# Altium schematic sheet 4-PWR_MANAGE_3.SCHDOC
size A4
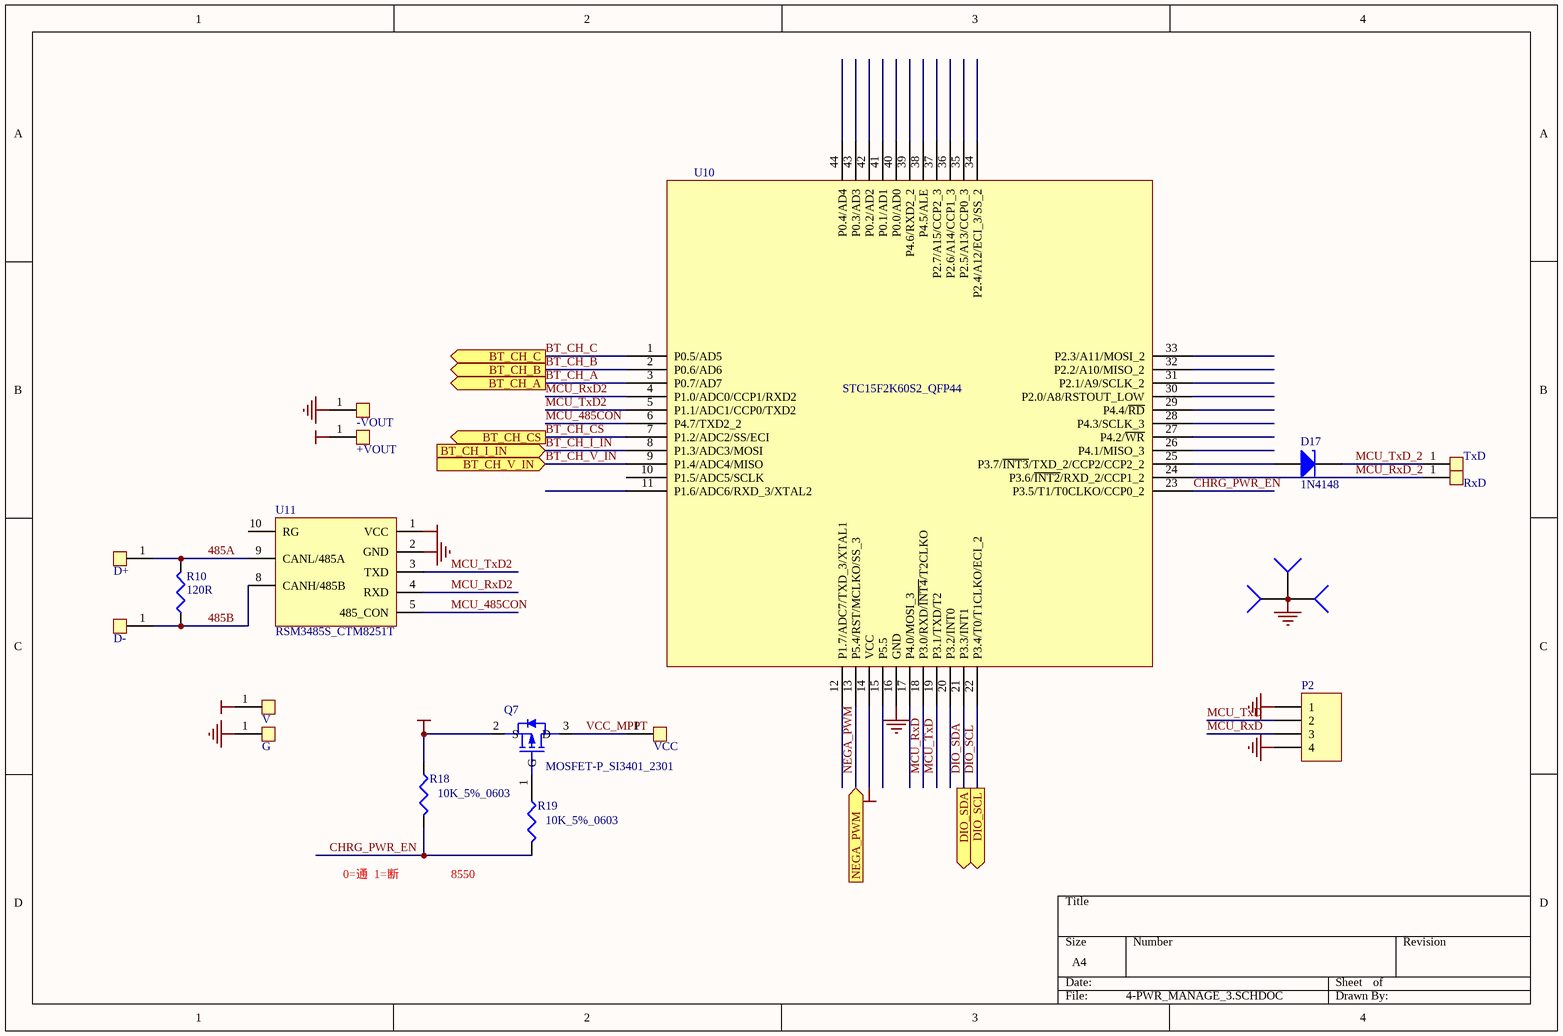
[diagram p0: 4-PWR_MANAGE_3.SCHDOC]

## Parts
+VOUT  ND  [END_1.5_2.2]  (value not drawn)
-VOUT  ND  [END_1.5_2.2]  (value not drawn)
D17  1N4148  [DSO-F2/D6.1]
D+  ND  [END_1.5_2.2]  (value not drawn)
D-  ND  [END_1.5_2.2]  (value not drawn)
G  ND  [END_1.5_2.2]  (value not drawn)
J1  COAX-F  [PAD_GND]  (value not drawn)
J2  COAX-F  [PAD_GND]  (value not drawn)
J3  COAX-F  [PAD_GND]  (value not drawn)
P2  Header 4  [XH-04H]  (value not drawn)
Q7  MOSFET-P_SI3401_2301  [SO-G3/C2.5]
R10  value 120R  [C1608-0603]  (hidden comment: Res3)
R18  10K_5%_0603  [C1608-0603]
R19  10K_5%_0603  [C1608-0603]
RxD  ND  [END_1.5_2.2]  (value not drawn)
TxD  ND  [END_1.5_2.2]  (value not drawn)
U10  STC15F2K60S2_QFP44  [PQFP44]
U11  RSM3485S_CTM8251T  [RSM485]
V  ND  [END_1.5_2.2]  (value not drawn)
VCC  ND  [END_1.5_2.2]  (value not drawn)

## Ports
BT_CH_A (out), BT_CH_B (out), BT_CH_C (out), BT_CH_CS (out), BT_CH_I_IN (in), BT_CH_V_IN (in), DIO_SCL (out), DIO_SDA (out), NEGA_PWM (in)

## Nets
GND: -VOUT.1(SW) G.1(SW) J1.1(A) J2.1(A) J3.1(A) P2.1 P2.4 U10.16(GND) U11.2(GND)
VCC_3V3: U10.14(VCC) U11.1(VCC)
VCC_BAT: +VOUT.1(SW)
VCC_CTRL_5V: Q7.2(S) R18.1 V.1(SW)
485A: D+.1(SW) R10.2 U11.9(CANL/485A)
485B: D-.1(SW) R10.1 U11.8(CANH/485B)
BT_CH_A: U10.3(P0.7/AD7) ; port BT_CH_A
BT_CH_B: U10.2(P0.6/AD6) ; port BT_CH_B
BT_CH_C: U10.1(P0.5/AD5) ; port BT_CH_C
BT_CH_CS: U10.7(P1.2/ADC2/SS/ECI) ; port BT_CH_CS
BT_CH_I_IN: U10.8(P1.3/ADC3/MOSI) ; port BT_CH_I_IN
BT_CH_V_IN: U10.9(P1.4/ADC4/MISO) ; port BT_CH_V_IN
CHRG_PWR_EN: R18.2 R19.2 U10.23(P3.5/T1/T0CLKO/CCP0_2)
DIO_SCL: U10.22(P3.4/T0/T1CLKO/ECI_2) ; port DIO_SCL
DIO_SDA: U10.21(P3.3/INT1) ; port DIO_SDA
MCU_485CON: U10.6(P4.7/TXD2_2) U11.5(485_CON)
MCU_RxD: P2.3 U10.18(P3.0/RXD/~{INT4}/T2CLKO)
MCU_RxD2: U10.4(P1.0/ADC0/CCP1/RXD2) U11.4(RXD)
MCU_RxD_2: RxD.1(SW) U10.24(P3.6/~{INT2}/RXD_2/CCP1_2)
MCU_TxD: P2.2 U10.19(P3.1/TXD/T2)
MCU_TxD2: U10.5(P1.1/ADC1/CCP0/TXD2) U11.3(TXD)
MCU_TxD_2: D17.2(K) TxD.1(SW)
NEGA_PWM: U10.13(P5.4/RST/MCLKO/SS_3) ; port NEGA_PWM
VCC_MPPT: Q7.3(D) VCC.1(SW)
NetD17_1: D17.1(A) U10.25(P3.7/~{INT3}/TXD_2/CCP2/CCP2_2)
NetQ7_1: Q7.1(G) R19.1

Not connected (* = marked no-connect by the designer): U10 10(P1.5/ADC5/SCLK) 11(P1.6/ADC6/RXD_3/XTAL2) 12(P1.7/ADC7/TXD_3/XTAL1) 15(P5.5) 17(P4.0/MOSI_3) 20(P3.2/INT0) 26(P4.1/MISO_3) 27(P4.2/~{WR}) 28(P4.3/SCLK_3) 29(P4.4/~{RD}) 30(P2.0/A8/RSTOUT_LOW) 31(P2.1/A9/SCLK_2) 32(P2.2/A10/MISO_2) 33(P2.3/A11/MOSI_2) 34(P2.4/A12/ECI_3/SS_2) 35(P2.5/A13/CCP0_3) 36(P2.6/A14/CCP1_3) 37(P2.7/A15/CCP2_3) 38(P4.5/ALE) 39(P4.6/RXD2_2) 40(P0.0/AD0) 41(P0.1/AD1) 42(P0.2/AD2) 43(P0.3/AD3) 44(P0.4/AD4); U11 10(RG)

## Notes on the sheet
- 0=通  1=断
- 8550

## Library data of the parts
D17 = D Tunnel1: Tunnel Diode - RLC Model; Published: 8-Jun-2000; LatestRevisionDate: 17-Jul-2002; LatestRevisionNote: Re-released for DXP Platform.; Publisher: Altium Limited
J1-J3 = COAX-F: Coax-F Connector; Revision: 17-Jul-2002: Re-released for DXP Platform.; Publisher: Altium Limited
P2 = Header 4: Header, 4-Pin; LatestRevisionDate: 17-Jul-2002; LatestRevisionNote: Re-released for DXP Platform.; Publisher: Altium Limited
Q7 = MOSFET-P
R10 = Res3: Resistor; Published: 8-Jun-2000; Revision: July-2002: Re-released for DXP Platform.; Publisher: Altium Limited
R18 R19 = Res3: Resistor; Value: 1K%5 0603; Published: 8-Jun-2000; Revision: July-2002: Re-released for DXP Platform.; Publisher: Altium Limited
U11 = RSM485S_CTM8251T